# Altium schematic sheet MSP-EXP430F5529LP_2.SchDoc: MSP-EXP430F5529LP
size 286 x 199 mm; Date: 2015/6/22 13:08:34; SheetNumber: 3; Origin: Eagle; GateName_1: G$1; SymbolName_1: DINA4_L; LibraryName: MSP-EXP430F5659; DeviceSetName: DINA4_L; GateName_2: G$2; SymbolName_2: DOCFIELD; Sheet: Sheet:; REV: REV:
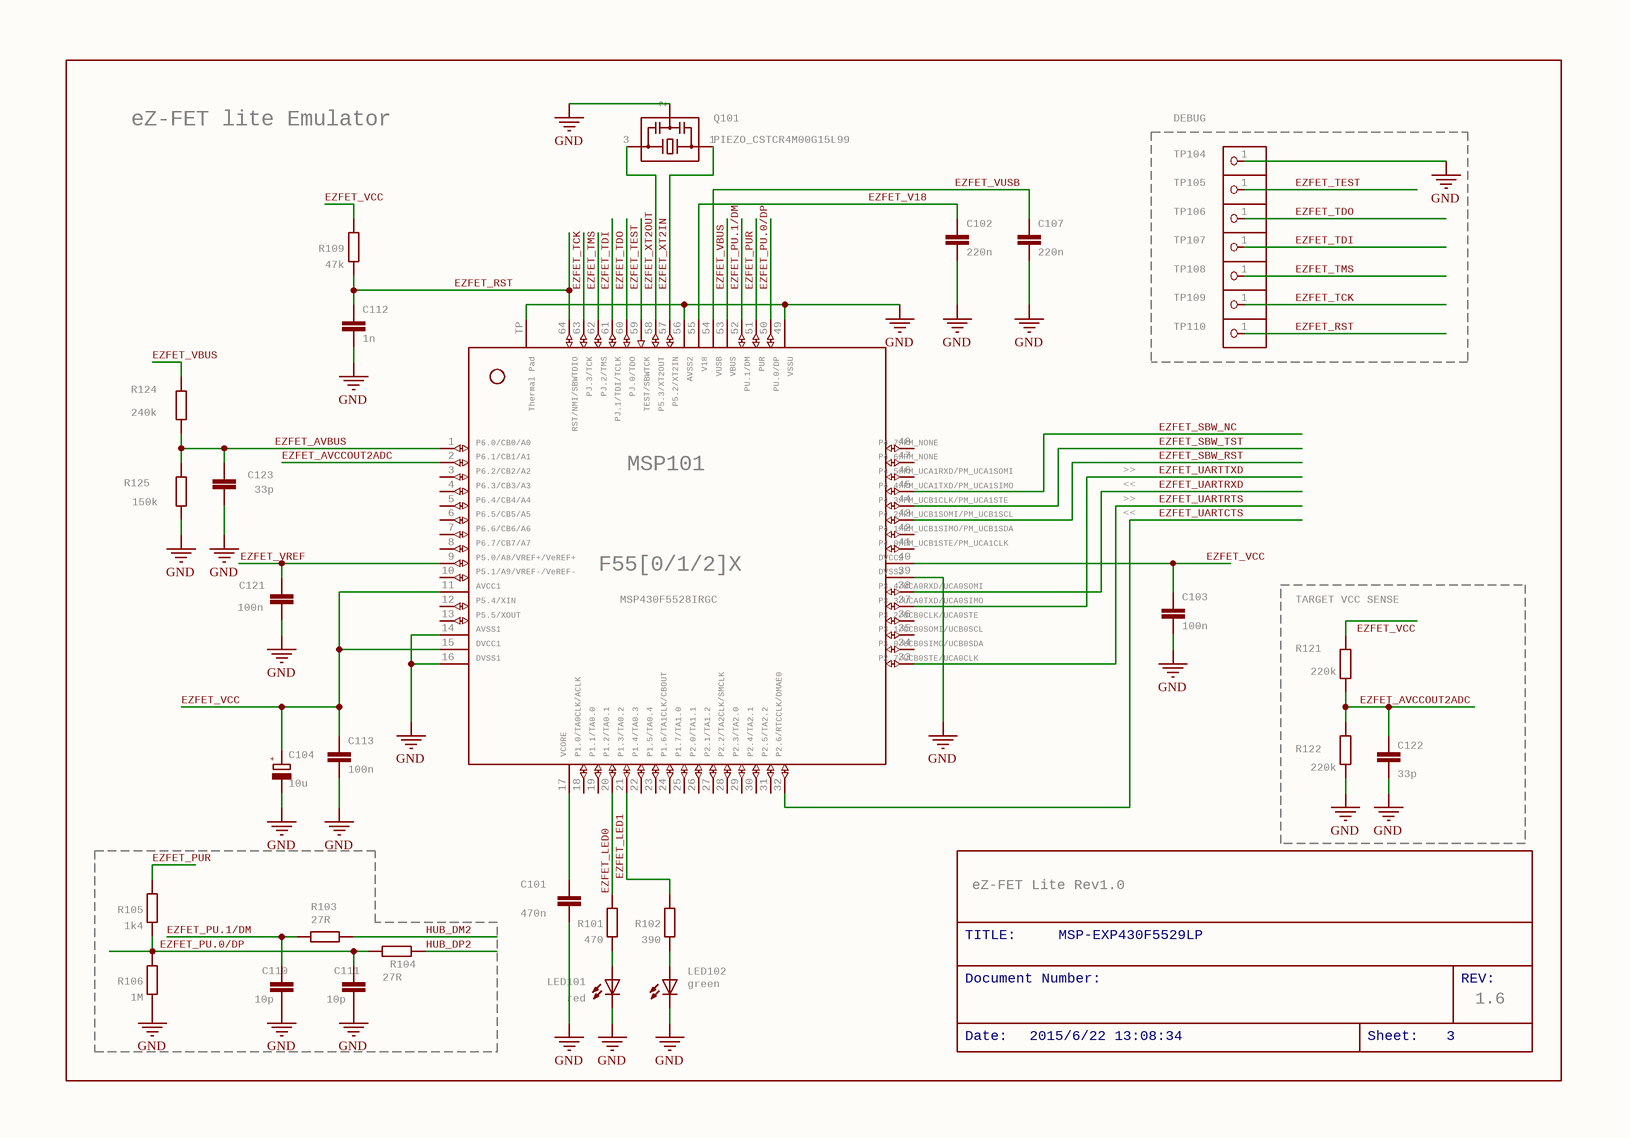
[diagram p0: MSP-EXP430F5529LP_2.SchDoc]

## Parts
C101  470n  [0402]
C102  220n  [0402]
C103  100n  [0402]
C104  10u  [A/3216-18R]
C107  220n  [0402]
C110  10p  [0402]
C111  10p  [0402]
C112  1n  [0402]
C113  100n  [0402]
C121  100n  [0402]
C122  33p  [0402]
C123  33p  [0402]
LED101  red  [CHIP-LED0603]
LED102  green  [CHIP-LED0603]
MSP101  ThermalPad: Thermal Pad  [RGC64]  (hidden comment: MSP430F5528IRGC)
Q101  PIEZO_CSTCR4M00G15L99  [MURATA-FILTER_CSTCR]
R101  470  [0402]
R102  390  [0402]
R103  27R  [0402]
R104  27R  [0402]
R105  1k4  [0402]
R106  1M  [0402]
R109  47k  [0402]
R121  220k  [0402]
R122  220k  [0402]
R124  240k  [0402]
R125  150k  [0402]
TP104  TEST_PIN2  [1X01]  (value not drawn)
TP105  TEST_PIN2  [1X01]  (value not drawn)
TP106  TEST_PIN2  [1X01]  (value not drawn)
TP107  TEST_PIN2  [1X01]  (value not drawn)
TP108  TEST_PIN2  [1X01]  (value not drawn)
TP109  TEST_PIN2  [1X01]  (value not drawn)
TP110  TEST_PIN2  [1X01]  (value not drawn)

## Blocks framed on the sheet
DEBUG: TP104-TP110
TARGET VCC SENSE: C122 R121 R122

## Nets
GND: C101.2 C102.2 C103.2 C104.- C107.2 C110.2 C111.2 C112.2 C113.2 C121.2 C122.1 C123.1 LED101.C LED102.C MSP101.14 MSP101.16 MSP101.39 MSP101.49 MSP101.56 MSP101.TP Q101.2 R106.1 R122.2 R125.2 TP104.1
EZFET_AVBUS: C123.2 MSP101.1 R124.2 R125.1
EZFET_AVCCOUT2ADC: C122.2 MSP101.2 R121.2 R122.1
EZFET_LED0: MSP101.20 R101.2
EZFET_LED1: MSP101.21 R102.2
EZFET_PU.0/DP: C111.1 MSP101.50 R104.2 R105.1 R106.2
EZFET_PU.1/DM: C110.1 MSP101.52 R103.2
EZFET_PUR: MSP101.51 R105.2
EZFET_RST: C112.1 MSP101.64 R109.1 TP110.1
EZFET_SBW_NC: MSP101.45
EZFET_SBW_RST: MSP101.43
EZFET_SBW_TST: MSP101.44
EZFET_TCK: MSP101.63 TP109.1
EZFET_TDI: MSP101.61 TP107.1
EZFET_TDO: MSP101.60 TP106.1
EZFET_TEST: MSP101.59 TP105.1
EZFET_TMS: MSP101.62 TP108.1
EZFET_UARTCTS: MSP101.32
EZFET_UARTRTS: MSP101.33
EZFET_UARTRXD: MSP101.38
EZFET_UARTTXD: MSP101.37
EZFET_V18: C102.1 MSP101.55
EZFET_VBUS: MSP101.53 R124.1
EZFET_VCC: C103.1 C104.+ C113.1 MSP101.11 MSP101.15 MSP101.40 R109.2 R121.1
EZFET_VREF: C121.1 MSP101.9
EZFET_VUSB: C107.1 MSP101.54
EZFET_XT2IN: MSP101.57 Q101.1
EZFET_XT2OUT: MSP101.58 Q101.3
HUB_DM2: R103.1
HUB_DP2: R104.1
NetC101_1: C101.1 MSP101.17
NetLED101_A: LED101.A R101.1
NetLED102_A: LED102.A R102.1

Not connected (* = marked no-connect by the designer): MSP101 3 4 5 6 7 8 10 12 13 18 19 22 23 24 25 26 27 28 29 30 31 34 35 36 41 42 46 47 48

## Notes on the sheet
- eZ-FET lite Emulator
- >>
- <<
- (near MSP101) MSP430F5528IRGC
- TITLE:
- eZ-FET Lite Rev1.0
- MSP-EXP430F5529LP
- Document Number:
- REV:
- 1.6
- Date:
- 2015/6/22 13:08:34
- Sheet:
- 3

## Library data of the parts
C101-C103 C107 C110-C113 C121-C123 = C-EUCM0402: CAPACITOR, European symbol; GateName_1: G$1; SymbolName_1: C-EU; DeviceName: CM0402; LibraryName: rcl; DeviceSetName: C-EU
C104 = CPOL-EUA/3216-18R: POLARIZED CAPACITOR, European symbol; GateName_1: G$1; SymbolName_1: CPOL; DeviceName: A/3216-18R; LibraryName: rcl; DeviceSetName: CPOL-EU; +: +
LED101 LED102 = LEDCHIP-LED0603: LED   OSRAM: - CHIPLED LG R971, LG N971, LY N971, LG Q971, LY Q971, LO R971, LY R971 LH N974, LH R974 LS Q976, LO Q976, LY Q976 LO Q996 - Hyper CHIPLED LW Q18S LB Q993, LB Q99A, LB R99A - SideLED LS A670, LO A670, LY A670, LG A670, LP A670 LB A673, LV A673, LT A673, LW A673 LH A674 LY A675 LS A676, LA A676, LO A676, LY A676, LW A676 LS A679, LY A679, LG A679 -  Hyper Micro SIDELED庐 LS Y876, LA Y876, LO Y876, LY Y876 LT Y87S - SmartLED LW L88C, LW L88S LB L89C, LB L89S, LG L890 LS L89K, LO L89K, LY L89K LS L896, LA L896, LO L896, LY L896 - TOPLED LS T670, LO T670, LY T670, LG T670, LP T670 LSG T670, LSP T670, LSY T670, LOP T670, LYG T670 LG T671, LOG T671, LSG T671 LB T673, LV T673, LT T673, LW T673 LH T674 LS T676, LA T676, LO T676, LY T676, LB T676, LH T676, LSB T676, LW T676 LB T67C, LV T67C, LT T67C, LS T67K, LO T67K, LY T67K, LW E67C LS E67B, LA E67B, LO E67B, LY E67B, LB E67C, LV E67C, LT E67C LW T67C LS T679, LY T679, LG T679 LS T770, LO T770, LY T770, LG T770, LP T770 LB T773, LV T773, LT T773, LW T773 LH T774 LS E675, LA E675, LY E675, LS T675 LS T776, LA T776, LO T776, LY T776, LB T776 LHGB T686 LT T68C, LB T68C - Hyper Mini TOPLED庐 LB M676 - Mini TOPLED Santana庐 LG M470 LS M47K, LO M47K, LY M47K    Source: http://www.osram.convergy.de   LUXEON: - LUMILED庐 LXK2-PW12-R00, LXK2-PW12-S00, LXK2-PW14-U00, LXK2-PW14-V00 LXK2-PM12-R00, LXK2-PM12-S00, LXK2-PM14-U00 LXK2-PE12-Q00, LXK2-PE12-R00, LXK2-PE12-S00, LXK2-PE14-T00, LXK2-PE14-U00 LXK2-PB12-K00, LXK2-PB12-L00, LXK2-PB12-M00, LXK2-PB14-N00, LXK2-PB14-P00, LXK2-PB14-Q00 LXK2-PR12-L00, LXK2-PR12-M00, LXK2-PR14-Q00, LXK2-PR14-R00 LXK2-PD12-Q00, LXK2-PD12-R00, LXK2-PD12-S00 LXK2-PH12-R00, LXK2-PH12-S00 LXK2-PL12-P00, LXK2-PL12-Q00, LXK2-PL12-R00    Source: www.luxeon.com   KINGBRIGHT:   KA-3528ASYC Source: www.kingbright.com; GateName_1: G$1; SymbolName_1: LED; DeviceName: CHIP-LED0603; LibraryName: led; DeviceSetName: LED
MSP101 = F55[0/1/2]X---RGC64: ***F55[0/1/2]X***RGC64 Rev. 1.0 06/2010 "http://www.ti.com/lit/gpn/msp430f5529" "http://www.ti.com/lit/gpn/msp430f5509" F5513/F5514 with limited Functions on some Pins; GateName_1: G$1; SymbolName_1: F55[0/1/2]X---RGC64; LibraryName: TI_MSP430_v16_intern; DeviceSetName: F55[0/1/2]X---RGC64; RST/NMI/SBWTDIO: RST/NMI/SBWTDIO; PJ.3/TCK: PJ.3/TCK; PJ.2/TMS: PJ.2/TMS; PJ.1/TDI/TCLK: PJ.1/TDI/TCLK; PJ.0/TDO: PJ.0/TDO; TEST/SBWTCK: TEST/SBWTCK; P5.3/XT2OUT: P5.3/XT2OUT; P5.2/XT2IN: P5.2/XT2IN; AVSS2: AVSS2; V18: V18; VUSB: VUSB; VBUS: VBUS; PU.1/DM: PU.1/DM; PUR: PUR; PU.0/DP: PU.0/DP; VSSU: VSSU; P6.0/CB0/A0: P6.0/CB0/A0; P6.1/CB1/A1: P6.1/CB1/A1; P6.2/CB2/A2: P6.2/CB2/A2; P6.3/CB3/A3: P6.3/CB3/A3; P6.4/CB4/A4: P6.4/CB4/A4; P6.5/CB5/A5: P6.5/CB5/A5; P6.6/CB6/A6: P6.6/CB6/A6; P6.7/CB7/A7: P6.7/CB7/A7; P5.0/A8/VREF+/VeREF+: P5.0/A8/VREF+/VeREF+; P5.1/A9/VREF-/VeREF-: P5.1/A9/VREF-/VeREF-; AVCC1: AVCC1; P5.4/XIN: P5.4/XIN; P5.5/XOUT: P5.5/XOUT; AVSS1: AVSS1; DVCC1: DVCC1; DVSS1: DVSS1; VCORE: VCORE; P1.0/TA0CLK/ACLK: P1.0/TA0CLK/ACLK; P1.1/TA0.0: P1.1/TA0.0; P1.2/TA0.1: P1.2/TA0.1; P1.3/TA0.2: P1.3/TA0.2; P1.4/TA0.3: P1.4/TA0.3; P1.5/TA0.4: P1.5/TA0.4; P1.6/TA1CLK/CBOUT: P1.6/TA1CLK/CBOUT; P1.7/TA1.0: P1.7/TA1.0; P2.0/TA1.1: P2.0/TA1.1; P2.1/TA1.2: P2.1/TA1.2; P2.2/TA2CLK/SMCLK: P2.2/TA2CLK/SMCLK; P2.3/TA2.0: P2.3/TA2.0; P2.4/TA2.1: P2.4/TA2.1; P2.5/TA2.2: P2.5/TA2.2; P2.6/RTCCLK/DMAE0: P2.6/RTCCLK/DMAE0; P4.7/PM_NONE: P4.7/PM_NONE; P4.6/PM_NONE: P4.6/PM_NONE; P4.5/PM_UCA1RXD/PM_UCA1SOMI: P4.5/PM_UCA1RXD/PM_UCA1SOMI; P4.4/PM_UCA1TXD/PM_UCA1SIMO: P4.4/PM_UCA1TXD/PM_UCA1SIMO; P4.3/PM_UCB1CLK/PM_UCA1STE: P4.3/PM_UCB1CLK/PM_UCA1STE; P4.2/PM_UCB1SOMI/PM_UCB1SCL: P4.2/PM_UCB1SOMI/PM_UCB1SCL; P4.1/PM_UCB1SIMO/PM_UCB1SDA: P4.1/PM_UCB1SIMO/PM_UCB1SDA; P4.0/PM_UCB1STE/PM_UCA1CLK: P4.0/PM_UCB1STE/PM_UCA1CLK; DVCC2: DVCC2; DVSS2: DVSS2; P3.4/UCA0RXD/UCA0SOMI: P3.4/UCA0RXD/UCA0SOMI; P3.3/UCA0TXD/UCA0SIMO: P3.3/UCA0TXD/UCA0SIMO; P3.2/UCB0CLK/UCA0STE: P3.2/UCB0CLK/UCA0STE; P3.1/UCB0SOMI/UCB0SCL: P3.1/UCB0SOMI/UCB0SCL; P3.0/UCB0SIMO/UCB0SDA: P3.0/UCB0SIMO/UCB0SDA; P2.7/UCB0STE/UCA0CLK: P2.7/UCB0STE/UCA0CLK; F55[0/1/2]X: F55[0/1/2]X
Q101 = MURATA-FILTER_CSTCR: Resonator   Source: murata.co.jp; MPN: CSTCR6M00G53-R0; GateName_1: G$1; SymbolName_1: MURATA-FILTER_CST; LibraryName: murata; DeviceSetName: MURATA-FILTER_CSTCR; MF: MF; OC_FARNELL: 1170434; OC_NEWARK: 25M8759
R101-R106 R109 R121 R122 R124 R125 = R-EU_RM0402: RESISTOR, European symbol; GateName_1: G$1; SymbolName_1: R-EU; DeviceName: RM0402; DeviceSetName: R-EU_; LibraryName: rcl
TP104-TP110 = PINHD-1X1: PIN HEADER; GateName_1: G$1; SymbolName_1: PINHD1; LibraryName: pinhead; DeviceSetName: PINHD-1X1